# EAGLE design PT4115_circiut_design (EAGLE 9.6.2)
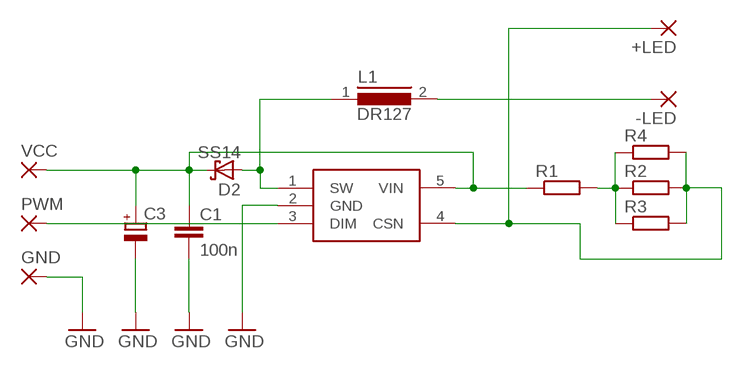
[diagram p0: schematic, sheet 1]

## Parts
+LED  SMD5  [SMD2,54-5,08]
-LED  SMD5  [SMD2,54-5,08]
C1  100n  C-EUC0805  [C0805]
C3  CPOL-EUSMCD  [SMC_D]
D2  SS14  [DO-214AC]
GND  SMD5  [SMD2,54-5,08]
L1  DR127  [DR127]
PWM  SMD5  [SMD2,54-5,08]
R1  R-EU_M0805  [M0805]
R2  R-EU_M0805  [M0805]
R3  R-EU_M0805  [M0805]
R4  R-EU_M0805  [M0805]
U$1  PT4115  [SOT-89-5]
VCC  SMD5  [SMD2,54-5,08]

## Nets
GND: C1.2 C3.- GND.1(P) U$1.2(GND)
N$1: PWM.1(P) U$1.3(DIM)
N$2: C1.1 C3.+ D2.K R1.1 U$1.5(VIN) VCC.1(P)
N$4: D2.A L1.1 U$1.1(SW)
N$5: -LED.1(P) L1.2
N$6: +LED.1(P) R2.2 R3.2 R4.2 U$1.4(CSN)
N$7: R1.2 R2.1 R3.1 R4.1

## Library data of the parts
+LED -LED GND PWM VCC = wirepad:SMD5: SMD PAD
C1 = rcl:C-EU: CAPACITOR, European symbol; SPICEPREFIX: C
C3 = rcl:CPOL-EU: POLARIZED CAPACITOR, European symbol; SPICEPREFIX: C
D2 = SS14:SS14: Diodo de barrera Schottky (1N5819 SMD) (VRRM): 40V, IRMS: 1A Check availability <https://pricing.snapeda.com/parts/SS14/ON%20Semiconductor/view-part?ref=eda>; AVAILABILITY: In Stock; DESCRIPTION: Diode Schottky 40 V 1A Surface Mount DO-214AC (SMA); MF: ON Semiconductor; MP: SS14; PACKAGE: SMA-2 ON Semiconductor; PRICE: None; PURCHASE-URL: https://pricing.snapeda.com/search/part/SS14/?ref=eda
L1 = inductors:DR127: High Power Density, High Efficiency, Shielded Inductors Source: coiltronics_dr_series.pdf; SPICEPREFIX: L
R1-R4 = rcl:R-EU_: RESISTOR, European symbol; SPICEPREFIX: R
U$1 = PT4115:PT4115: 30V, 1.2A Step-down HIgh Brightness LED Driver with 5000:1 Dimming Check availability <https://pricing.snapeda.com/parts/PT4115/Pulse/view-part?ref=eda>; AVAILABILITY: In Stock; MF: Pulse; MP: PT4115; PACKAGE: None; PRICE: None

## Board
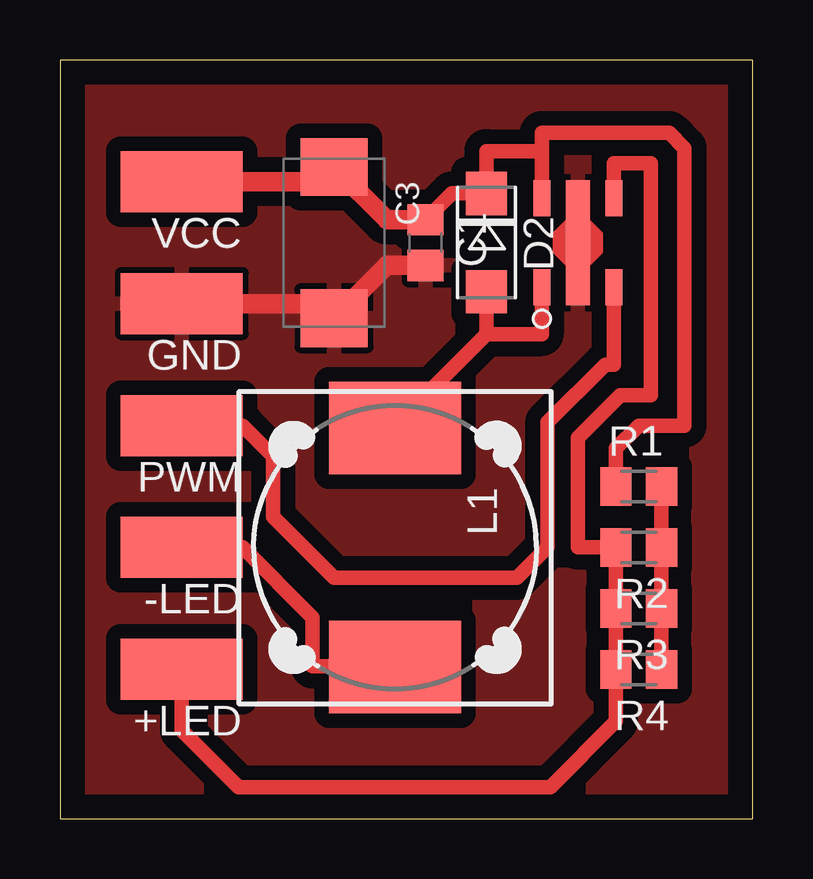
[diagram p1: board, top side]

Size 28.88 x 31.61 mm. Coordinates in mm from the lower left corner, seen from the top.
Outline: 0,0 28.88,0 28.88,31.61 0,31.61 0,0
Copper layers (1*16): Top 0.035mm / dielectric 1.5mm / Bottom 0.035mm
Design rules "default": minimum track width 6mil, minimum drill 0.35mm, track to track 6mil, track to pad 6mil, pad to pad 6mil, via to via 6mil, smd to smd 6mil, copper to edge 40mil, drill to drill 6mil, minimum pad ring 10mil, minimum via ring 8mil, stop-mask expansion 4mil, vias tented up to drill 0mil, thermal gap 10mil

### Footprints (pad centres in the part's own frame; a part is rotated, then mirrored left to right if it is on the bottom)
SMD2,54-5,08 = smd 2.54 x 5.08: 1 0,0
C0805 = smd 1.3 x 1.5: 1 -0.95,0; 2 0.95,0
SMC_D = smd 2.4 x 2.8: + -3.15,0; - 3.15,0
DO-214AC = smd 1.8 x 1.7: A 2.05,0; K -2.05,0
DR127 = smd 3.85 x 5.5: 1 -4.975,0; 2 4.975,0
M0805 = smd 1.3 x 1.6: 1 -0.95,0; 2 0.95,0
SOT-89-5 = smd 0.7 x 1.5: 1 -1.5,-1.85; 3 1.5,-1.85; 4 1.5,1.85; 5 -1.5,1.85 | smd 1 x 5.2: 2 0,0

### Placement (x,y rotation side)
+LED  5.08,6.22 90 top
-LED  5.08,11.3 90 top
C1  15.24,24 270 top
C3  11.43,24 270 top
D2  17.78,24 270 top
GND  5.08,21.46 90 top
L1  13.97,11.3 270 top
PWM  5.08,16.38 90 top
R1  24.13,13.84 0 top
R2  24.13,11.3 180 top
R3  24.13,8.76 180 top
R4  24.13,6.22 180 top
U$1  21.59,24 0 top
VCC  5.08,26.54 90 top

### Tracks (layer width: path | path; a pad name or v marks a point on that pad's centre or on a via)
GND
  Top 0.813: C1.2 13.63,23.05 C3.- 10.82,21.46 GND.1
  pour Top (isolate 0.61): 1.27,0.38 1.27,30.35 27.94,30.35 27.94,0.38
N$1
  Top 0.61: 6.35,16.38 PWM.1 7.62,16.38 8.89,15.11 8.89,12.57 11.43,10.03 19.05,10.03 20.32,11.3 20.32,16.51 22.73,18.92 23.09,18.92 U$1.3
N$2
  Top 0.61: 15.56,25.27 C1.1 16.34,26.05 D2.K 17.78,27.81 20.09,27.81 | R1.1 23.18,15.43 24.13,16.38 26.04,16.38 26.04,27.94 25.4,28.57 20.09,28.57 20.09,27.81 | 20.09,27.81 U$1.5
  Top 0.813: C1.1 13.63,24.95 C3.+ 10.82,26.54 VCC.1
N$4
  Top 0.61: L1.1 13.97,16.38 17.78,20.19 | 17.78,20.19 20.09,20.19 U$1.1 | 17.78,20.19 D2.A
N$5
  Top 0.61: -LED.1 7.62,11.3 10.54,8.38 10.54,6.35 13.95,6.35 L1.2
N$6
  Top 0.61: +LED.1 5.08,3.68 7.44,1.32 20.45,1.32 23.18,4.05 R4.2 R3.2 R2.2 21.59,11.3 21.59,15.88 23.37,17.65 24.64,17.65 24.64,27.3 23.09,27.3 U$1.4
N$7
  Top 0.61: R4.1 R3.1 R2.1 R1.2